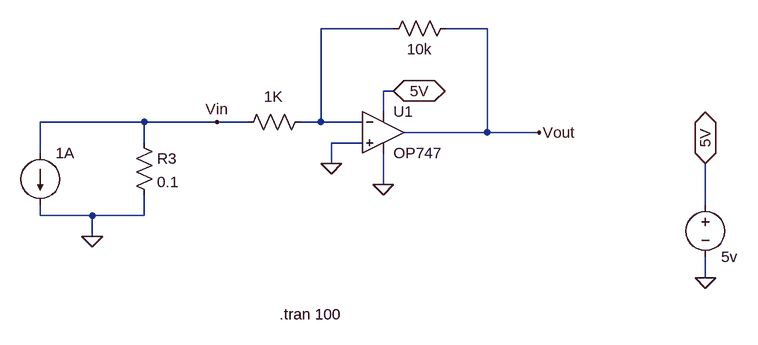
[diagram p0: schematic current_Measurements.asc]
current_Measurements.asc, the LTspice schematic file:
Version 4
SHEET 1 1580 680
WIRE 240 0 128 0
WIRE 384 0 320 0
WIRE 240 96 224 96
WIRE 224 128 224 96
WIRE -144 144 -304 144
WIRE -32 144 -144 144
WIRE 16 144 -32 144
WIRE 128 144 128 0
WIRE 128 144 96 144
WIRE 192 144 128 144
WIRE 384 160 384 0
WIRE 384 160 256 160
WIRE 464 160 384 160
WIRE -144 176 -144 144
WIRE 192 176 144 176
WIRE -304 192 -304 144
WIRE 144 208 144 176
WIRE 224 240 224 192
WIRE 720 272 720 208
WIRE -304 288 -304 272
WIRE -224 288 -304 288
WIRE -144 288 -144 256
WIRE -144 288 -224 288
WIRE -224 320 -224 288
WIRE 720 384 720 352
FLAG -32 144 Vin
FLAG 464 160 Vout
FLAG 720 384 0
FLAG 720 208 5V
IOPIN 720 208 BiDir
FLAG 240 96 5V
IOPIN 240 96 BiDir
FLAG 224 240 0
FLAG -224 320 0
FLAG 144 208 0
SYMBOL res 0 160 R270
WINDOW 0 32 56 Invisible 2
WINDOW 3 71 55 VBottom 2
SYMATTR InstName R1
SYMATTR Value 1K
SYMBOL res 336 -16 R90
WINDOW 0 0 56 Invisible 2
WINDOW 3 32 56 VTop 2
SYMATTR InstName R2
SYMATTR Value 10k
SYMBOL current -304 192 R0
WINDOW 0 24 80 Invisible 2
WINDOW 3 24 0 Left 2
WINDOW 123 0 0 Left 0
WINDOW 39 0 0 Left 0
SYMATTR InstName I1
SYMATTR Value 1A
SYMBOL voltage 720 256 R0
WINDOW 0 24 16 Invisible 2
WINDOW 123 0 0 Left 0
WINDOW 39 0 0 Left 0
SYMATTR InstName V1
SYMATTR Value 5v
SYMBOL res -160 160 R0
SYMATTR InstName R3
SYMATTR Value 0.1
SYMBOL OpAmps\\OP747 224 96 R0
SYMATTR InstName U1
TEXT 64 440 Left 2 !.tran 100

The netlist it stands for:
* current_Measurements.asc
R1 Vin N001 1K
R2 Vout N001 10k
I1 Vin 0 1A
V1 5V 0 5v
R3 Vin 0 0.1
XU1 0 N001 5V 0 Vout OP747  ; pins In+ In- V+ V- OUT
.tran 100
.backanno
.end